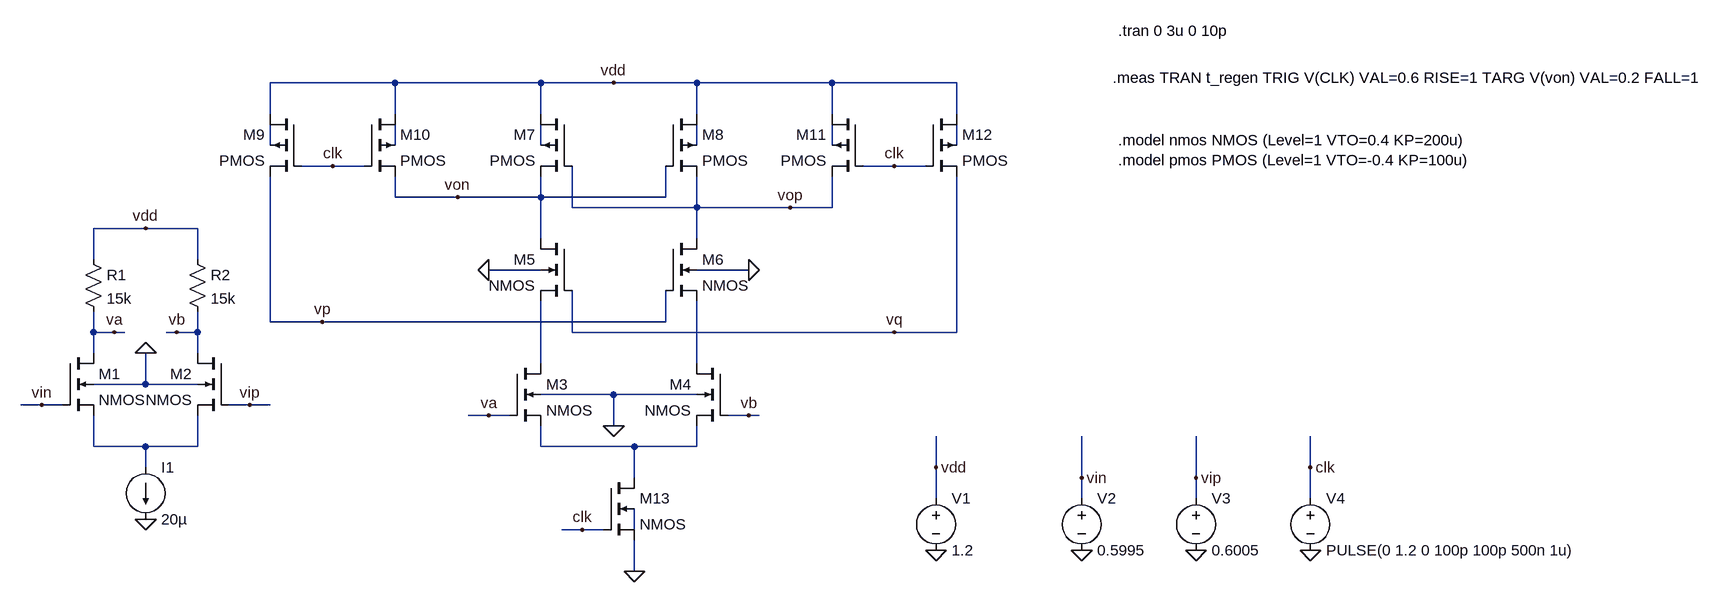
[diagram p0: schematic comparator.asc]
comparator.asc, the LTspice schematic file:
Version 4
SHEET 1 2476 680
WIRE 416 -192 224 -192
WIRE 640 -192 416 -192
WIRE 752 -192 640 -192
WIRE 880 -192 752 -192
WIRE 1088 -192 880 -192
WIRE 1280 -192 1088 -192
WIRE 224 -144 224 -192
WIRE 416 -144 416 -192
WIRE 640 -144 640 -192
WIRE 880 -144 880 -192
WIRE 1088 -144 1088 -192
WIRE 1280 -144 1280 -192
WIRE 224 -96 224 -128
WIRE 416 -96 416 -128
WIRE 640 -96 640 -128
WIRE 880 -96 880 -128
WIRE 1088 -96 1088 -128
WIRE 1280 -96 1280 -128
WIRE 320 -64 272 -64
WIRE 368 -64 320 -64
WIRE 1184 -64 1136 -64
WIRE 1232 -64 1184 -64
WIRE 416 -16 416 -48
WIRE 512 -16 416 -16
WIRE 640 -16 640 -48
WIRE 640 -16 512 -16
WIRE 832 -16 832 -64
WIRE 832 -16 640 -16
WIRE 688 0 688 -64
WIRE 880 0 880 -48
WIRE 880 0 688 0
WIRE 1024 0 880 0
WIRE 1088 0 1088 -48
WIRE 1088 0 1024 0
WIRE 32 32 -48 32
WIRE 112 32 32 32
WIRE 640 48 640 -16
WIRE 880 48 880 0
WIRE -48 80 -48 32
WIRE 112 80 112 32
WIRE 640 96 560 96
WIRE 960 96 880 96
WIRE 224 176 224 -48
WIRE 304 176 224 176
WIRE 832 176 832 128
WIRE 832 176 304 176
WIRE -48 192 -48 160
WIRE -16 192 -48 192
WIRE 0 192 -16 192
WIRE 80 192 64 192
WIRE 112 192 112 160
WIRE 112 192 80 192
WIRE 688 192 688 128
WIRE 1184 192 688 192
WIRE 1280 192 1280 -48
WIRE 1280 192 1184 192
WIRE -48 224 -48 192
WIRE 112 224 112 192
WIRE 640 240 640 144
WIRE 880 240 880 144
WIRE 32 272 32 224
WIRE 32 272 -48 272
WIRE 112 272 32 272
WIRE 752 288 640 288
WIRE 880 288 752 288
WIRE -128 304 -160 304
WIRE -96 304 -128 304
WIRE 192 304 160 304
WIRE 224 304 192 304
WIRE 560 320 528 320
WIRE 592 320 560 320
WIRE 960 320 928 320
WIRE 976 320 960 320
WIRE 752 336 752 288
WIRE -48 368 -48 320
WIRE 32 368 -48 368
WIRE 112 368 112 320
WIRE 112 368 32 368
WIRE 640 368 640 336
WIRE 784 368 640 368
WIRE 880 368 880 336
WIRE 880 368 784 368
WIRE 32 400 32 368
WIRE 1248 400 1248 352
WIRE 1824 400 1824 352
WIRE 784 416 784 368
WIRE 1472 416 1472 352
WIRE 1648 416 1648 352
WIRE 1248 448 1248 400
WIRE 1472 448 1472 416
WIRE 1648 448 1648 416
WIRE 1824 448 1824 400
WIRE 704 496 672 496
WIRE 736 496 704 496
WIRE 784 496 784 464
WIRE 784 560 784 512
FLAG 784 560 0
FLAG 752 336 0
FLAG 32 224 0
FLAG 32 480 0
FLAG 1824 528 0
FLAG 1648 528 0
FLAG 1472 528 0
FLAG 1248 528 0
FLAG 32 32 vdd
FLAG 752 -192 vdd
FLAG 1248 400 vdd
FLAG 1472 416 vin
FLAG -128 304 vin
FLAG 1648 416 vip
FLAG 192 304 vip
FLAG -16 192 va
FLAG 560 320 va
FLAG 80 192 vb
FLAG 960 320 vb
FLAG 1824 400 clk
FLAG 320 -64 clk
FLAG 1184 -64 clk
FLAG 704 496 clk
FLAG 512 -16 von
FLAG 1024 0 vop
FLAG 304 176 vp
FLAG 1184 192 vq
FLAG 560 96 0
FLAG 960 96 0
SYMBOL res -64 64 R0
SYMATTR InstName R1
SYMATTR Value 15k
SYMBOL res 96 64 R0
SYMATTR InstName R2
SYMATTR Value 15k
SYMBOL nmos4 -96 224 R0
SYMATTR InstName M1
SYMATTR Value2 l=100n w=2u
SYMBOL nmos4 160 224 M0
SYMATTR InstName M2
SYMATTR Value2 l=100n w=2u
SYMBOL current 32 400 R0
WINDOW 123 0 0 Left 0
WINDOW 39 0 0 Left 0
SYMATTR InstName I1
SYMATTR Value 20µ
SYMBOL nmos4 592 240 R0
SYMATTR InstName M3
SYMATTR Value2 l=100n w=2u
SYMBOL nmos4 928 240 M0
SYMATTR InstName M4
SYMATTR Value2 l=100n w=2u
SYMBOL nmos4 688 48 M0
SYMATTR InstName M5
SYMATTR Value2 l=100n w=1u
SYMBOL nmos4 832 48 R0
SYMATTR InstName M6
SYMATTR Value2 l=100n w=1u
SYMBOL pmos4 688 -144 M0
SYMATTR InstName M7
SYMATTR Value2 l=100n w=2u
SYMBOL pmos4 832 -144 R0
SYMATTR InstName M8
SYMATTR Value2 l=100n w=2u
SYMBOL pmos4 272 -144 M0
SYMATTR InstName M9
SYMATTR Value2 l=100n w=1u
SYMBOL pmos4 368 -144 R0
SYMATTR InstName M10
SYMATTR Value2 l=100n w=1u
SYMBOL pmos4 1136 -144 M0
SYMATTR InstName M11
SYMATTR Value2 l=100n w=1u
SYMBOL pmos4 1232 -144 R0
SYMATTR InstName M12
SYMATTR Value2 l=100n w=1u
SYMBOL nmos4 736 416 R0
SYMATTR InstName M13
SYMATTR Value2 l=100n w=4u
SYMBOL voltage 1248 432 R0
WINDOW 123 0 0 Left 0
WINDOW 39 0 0 Left 0
SYMATTR InstName V1
SYMATTR Value 1.2
SYMBOL voltage 1472 432 R0
WINDOW 123 0 0 Left 0
WINDOW 39 0 0 Left 0
SYMATTR InstName V2
SYMATTR Value 0.5995
SYMBOL voltage 1648 432 R0
WINDOW 123 0 0 Left 0
WINDOW 39 0 0 Left 0
SYMATTR InstName V3
SYMATTR Value 0.6005
SYMBOL voltage 1824 432 R0
WINDOW 123 0 0 Left 0
WINDOW 39 0 0 Left 0
SYMATTR InstName V4
SYMATTR Value PULSE(0 1.2 0 100p 100p 500n 1u)
TEXT 1528 -272 Left 2 !.tran 0 3u 0 10p
TEXT 1520 -200 Left 2 !.meas TRAN t_regen TRIG V(CLK) VAL=0.6 RISE=1 TARG V(von) VAL=0.2 FALL=1
TEXT 1528 -104 Left 2 !.model nmos NMOS (Level=1 VTO=0.4 KP=200u)\n.model pmos PMOS (Level=1 VTO=-0.4 KP=100u)

The netlist it stands for:
* comparator.asc
R1 vdd va 15k
R2 vdd vb 15k
M1 va vin N009 0 NMOS l=100n w=2u
M2 vb vip N009 0 NMOS l=100n w=2u
I1 N009 0 20µ
M3 N007 va N010 0 NMOS l=100n w=2u
M4 N008 vb N010 0 NMOS l=100n w=2u
M5 von vq N007 0 NMOS l=100n w=1u
M6 vop vp N008 0 NMOS l=100n w=1u
M7 vdd vop von N003 PMOS l=100n w=2u
M8 vdd von vop N004 PMOS l=100n w=2u
M9 vdd clk vp N001 PMOS l=100n w=1u
M10 vdd clk von N002 PMOS l=100n w=1u
M11 vdd clk vop N005 PMOS l=100n w=1u
M12 vdd clk vq N006 PMOS l=100n w=1u
M13 N010 clk 0 N011 NMOS l=100n w=4u
V1 vdd 0 1.2
V2 vin 0 0.5995
V3 vip 0 0.6005
V4 clk 0 PULSE(0 1.2 0 100p 100p 500n 1u)
.model NMOS NMOS
.model PMOS PMOS
.lib standard.mos
.tran 0 3u 0 10p
.meas TRAN t_regen TRIG V(CLK) VAL=0.6 RISE=1 TARG V(von) VAL=0.2 FALL=1
.model nmos NMOS (Level=1 VTO=0.4 KP=200u)
.model pmos PMOS (Level=1 VTO=-0.4 KP=100u)
.backanno
.end